# Altium schematic sheet Chip.SchDoc
size A4; SheetNumber: 2; SheetTotal: 4
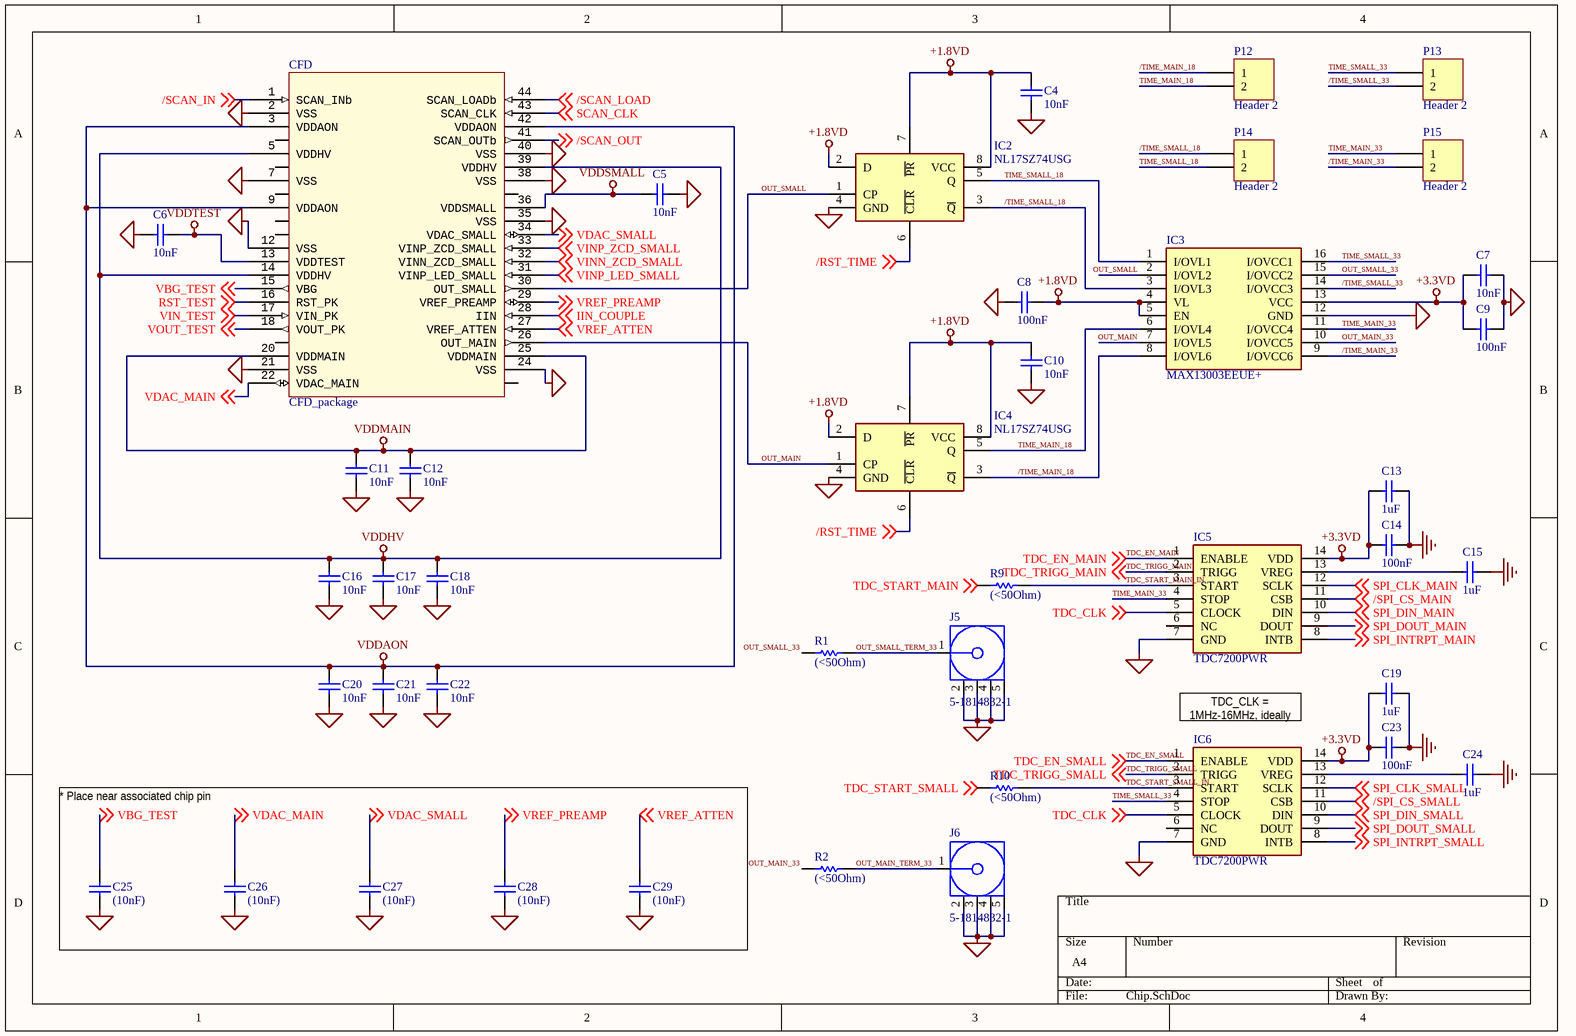
[diagram p0: Chip.SchDoc]

## Parts
C4  10nF  [CAPC1608X90X35ML10T15]
C5  10nF  [CAPC1608X90X35ML10T15]
C6  10nF  [CAPC1608X90X35ML10T15]
C7  10nF  [CAPC1608X90X35ML10T15]
C8  100nF  [CAPC1608X90X35ML10T15]
C9  100nF  [CAPC1608X90X35ML10T15]
C10  10nF  [CAPC1608X90X35ML10T15]
C11  10nF  [CAPC1608X90X35ML10T15]
C12  10nF  [CAPC1608X90X35ML10T15]
C13  1uF  [CAPC1608X90X35ML10T15]
C14  100nF  [CAPC1608X90X35ML10T15]
C15  1uF  [CAPC1608X90X35ML10T15]
C16  10nF  [CAPC1608X90X35ML10T15]
C17  10nF  [CAPC1608X90X35ML10T15]
C18  10nF  [CAPC1608X90X35ML10T15]
C19  1uF  [CAPC1608X90X35ML10T15]
C20  10nF  [CAPC1608X90X35ML10T15]
C21  10nF  [CAPC1608X90X35ML10T15]
C22  10nF  [CAPC1608X90X35ML10T15]
C23  100nF  [CAPC1608X90X35ML10T15]
C24  1uF  [CAPC1608X90X35ML10T15]
C25  (10nF)  [CAPC1608X90X35ML10T15]
C26  (10nF)  [CAPC1608X90X35ML10T15]
C27  (10nF)  [CAPC1608X90X35ML10T15]
C28  (10nF)  [CAPC1608X90X35ML10T15]
C29  (10nF)  [CAPC1608X90X35ML10T15]
CFD  CFD_package  [QFN50P700X700X80_HS-45N_WIDEVIAS]
IC2  NL17SZ74USG  [SOP50P310X90-8N]
IC3  MAX13003EEUE+  [SOP65P640X110-16N]
IC4  NL17SZ74USG  [SOP50P310X90-8N]
IC5  TDC7200PWR  [SOP65P640X120-14N]
IC6  TDC7200PWR  [SOP65P640X120-14N]
J5  5-1814832-1  [TECO-5-1814832-1_V]
J6  5-1814832-1  [TECO-5-1814832-1_V]
P12  Header 2  [HDR1X2]
P13  Header 2  [HDR1X2]
P14  Header 2  [HDR1X2]
P15  Header 2  [HDR1X2]
R1  (<50Ohm)  [RESC1609X50X30NL8T20]
R2  (<50Ohm)  [RESC1609X50X30NL8T20]
R9  (<50Ohm)  [RESC1609X50X30NL8T20]
R10  (<50Ohm)  [RESC1609X50X30NL8T20]

## Nets
+1.8VD: C4.2 C8.2 C10.2 IC2.2(D) IC2.7(~{PR}) IC2.8(VCC) IC3.4(VL) IC3.5(EN) IC4.2(D) IC4.7(~{PR}) IC4.8(VCC)
+3.3VD: C7.2 C9.2 C13.1 C14.1 C19.1 C23.1 IC3.13(VCC) IC5.14(VDD) IC6.14(VDD)
GND: C4.1 C5.1 C6.2 C7.1 C8.1 C9.1 C10.1 C11.1 C12.1 C13.2 C14.2 C15.2 C16.1 C17.1 C18.1 C19.2 C20.1 C21.1 C22.1 C23.2 C24.2 C25.1 C26.1 C27.1 C28.1 C29.1 CFD.2(VSS) CFD.7(VSS) CFD.12(VSS) CFD.21(VSS) CFD.24(VSS) CFD.35(VSS) CFD.38(VSS) CFD.40(VSS) IC2.4(GND) IC3.12(GND) IC4.4(GND) IC5.7(GND) IC6.7(GND) J5.2 J5.3 J5.4 J5.5 J6.2 J6.3 J6.4 J6.5
VDDAON: C20.2 C21.2 C22.2 CFD.3(VDDAON) CFD.9(VDDAON) CFD.42(VDDAON)
VDDHV: C16.2 C17.2 C18.2 CFD.5(VDDHV) CFD.14(VDDHV) CFD.39(VDDHV)
VDDMAIN: C11.2 C12.2 CFD.20(VDDMAIN) CFD.25(VDDMAIN)
VDDSMALL: C5.2 CFD.36(VDDSMALL)
VDDTEST: C6.1 CFD.13(VDDTEST)
/RST_TIME: IC2.6(~{CLR}) IC4.6(~{CLR}) ; off-sheet /RST_TIME
/SCAN_IN: CFD.1(SCAN_INb) ; off-sheet /SCAN_IN
/SCAN_LOAD: CFD.44(SCAN_LOADb) ; off-sheet /SCAN_LOAD
/SCAN_OUT: CFD.41(SCAN_OUTb) ; off-sheet /SCAN_OUT
/SPI_CS_MAIN: IC5.11(CSB) ; off-sheet /SPI_CS_MAIN
/SPI_CS_SMALL: IC6.11(CSB) ; off-sheet /SPI_CS_SMALL
/TIME_MAIN_18: IC3.8(I/OVL6) IC4.3(~{Q}) P12.1
/TIME_MAIN_33: IC3.9(I/OVCC6) P15.2
/TIME_SMALL_18: IC2.3(~{Q}) IC3.3(I/OVL3) P14.1
/TIME_SMALL_33: IC3.14(I/OVCC3) P13.2
IIN_COUPLE: CFD.28(IIN) ; off-sheet IIN_COUPLE
OUT_MAIN: CFD.26(OUT_MAIN) IC3.7(I/OVL5) IC4.1(CP)
OUT_MAIN_33: IC3.10(I/OVCC5) R2.2
OUT_MAIN_TERM_33: J6.1 R2.1
OUT_SMALL: CFD.30(OUT_SMALL) IC2.1(CP) IC3.2(I/OVL2)
OUT_SMALL_33: IC3.15(I/OVCC2) R1.2
OUT_SMALL_TERM_33: J5.1 R1.1
RST_TEST: CFD.16(RST_PK) ; off-sheet RST_TEST
SCAN_CLK: CFD.43(SCAN_CLK) ; off-sheet SCAN_CLK
SPI_CLK_MAIN: IC5.12(SCLK) ; off-sheet SPI_CLK_MAIN
SPI_CLK_SMALL: IC6.12(SCLK) ; off-sheet SPI_CLK_SMALL
SPI_DIN_MAIN: IC5.10(DIN) ; off-sheet SPI_DIN_MAIN
SPI_DIN_SMALL: IC6.10(DIN) ; off-sheet SPI_DIN_SMALL
SPI_DOUT_MAIN: IC5.9(DOUT) ; off-sheet SPI_DOUT_MAIN
SPI_DOUT_SMALL: IC6.9(DOUT) ; off-sheet SPI_DOUT_SMALL
SPI_INTRPT_MAIN: IC5.8(INTB) ; off-sheet SPI_INTRPT_MAIN
SPI_INTRPT_SMALL: IC6.8(INTB) ; off-sheet SPI_INTRPT_SMALL
TDC_CLK: IC5.5(CLOCK) IC6.5(CLOCK) ; off-sheet TDC_CLK
TDC_EN_MAIN: IC5.1(ENABLE) ; off-sheet TDC_EN_MAIN
TDC_EN_SMALL: IC6.1(ENABLE) ; off-sheet TDC_EN_SMALL
TDC_START_MAIN: R9.2 ; off-sheet TDC_START_MAIN
TDC_START_MAIN_IN: IC5.3(START) R9.1
TDC_START_SMALL: R10.2 ; off-sheet TDC_START_SMALL
TDC_START_SMALL_IN: IC6.3(START) R10.1
TDC_TRIGG_MAIN: IC5.2(TRIGG) ; off-sheet TDC_TRIGG_MAIN
TDC_TRIGG_SMALL: IC6.2(TRIGG) ; off-sheet TDC_TRIGG_SMALL
TIME_MAIN_18: IC3.6(I/OVL4) IC4.5(Q) P12.2
TIME_MAIN_33: IC3.11(I/OVCC4) IC5.4(STOP) P15.1
TIME_SMALL_18: IC2.5(Q) IC3.1(I/OVL1) P14.2
TIME_SMALL_33: IC3.16(I/OVCC1) IC6.4(STOP) P13.1
VBG_TEST: C25.2 CFD.15(VBG) ; off-sheet VBG_TEST
VDAC_MAIN: C26.2 CFD.22(VDAC_MAIN) ; off-sheet VDAC_MAIN
VDAC_SMALL: C27.2 CFD.34(VDAC_SMALL) ; off-sheet VDAC_SMALL
VIN_TEST: CFD.17(VIN_PK) ; off-sheet VIN_TEST
VINN_ZCD_SMALL: CFD.32(VINN_ZCD_SMALL) ; off-sheet VINN_ZCD_SMALL
VINP_LED_SMALL: CFD.31(VINP_LED_SMALL) ; off-sheet VINP_LED_SMALL
VINP_ZCD_SMALL: CFD.33(VINP_ZCD_SMALL) ; off-sheet VINP_ZCD_SMALL
VOUT_TEST: CFD.18(VOUT_PK) ; off-sheet VOUT_TEST
VREF_ATTEN: C29.2 CFD.27(VREF_ATTEN) ; off-sheet VREF_ATTEN
VREF_PREAMP: C28.2 CFD.29(VREF_PREAMP) ; off-sheet VREF_PREAMP
NetC15_1: C15.1 IC5.13(VREG)
NetC24_1: C24.1 IC6.13(VREG)

Not connected (* = marked no-connect by the designer): CFD 4 6 8 10 11 19 23 37; IC5 6(NC); IC6 6(NC)

## Notes on the sheet
- TDC_CLK = 1MHz-16MHz, ideally 16MHz
- * Place near associated chip pin

## Library data of the parts
C4-C29 = CMP-2000-04945-1: 0603; Manufacturer: Murata; Capacitance: 22pF; Tolerance (%): ±5%; Rated Voltage: 50V; Dielectric: C0G; Manufacturer URL: http://www.murata.com/; Datasheet Version: Jul-06; Package Reference: 603; Case Size/Dimension: 0603; Package Description: 2-Pin Surface Mount Device, Body 1.6 x 0.8 mm; Datasheet URL: https://datasheet.ciiva.com/11786/0900766b807a1cab-11786398.pdf
IC2 IC4 = NL17SZ74USG: Flip Flops 1.65-5.5V CMOS Single D-Type; Manufacturer_Name: ON Semiconductor; Datasheet Link: http://www.onsemi.com/pub/Collateral/NL17SZ74-D.PDF; Height: 0.9mm; Manufacturer_Part_Number: NL17SZ74USG
IC3 = MAX13003EEUE+: Integrated Circuit; Manufacturer_Name: Maxim Integrated; Datasheet Link: https://pdfserv.maximintegrated.com/en/ds/MAX13000E-MAX13005E.pdf; Height: 1.1mm; Manufacturer_Part_Number: MAX13003EEUE+
IC5 IC6 = TDC7200PWR: Integrated Circuit; Manufacturer_Name: Texas Instruments; Datasheet Link: http://www.ti.com/lit/gpn/tdc7200; Height: 1.2mm; Manufacturer_Part_Number: TDC7200PWR
J5 J6 = CMP-2000-05415-1: SMA Connector, Pitch 5.08 mm, 1 Position, Height 9.5 mm, Tail Length 4 mm, -65 to 165 degC, RoHS, Bulk; Manufacturer: TE Connectivity; Connector Mounting: PCBMount; Connector Body Style: StraightJack; Impedance: 50ohm; Coaxial Termination: Solder; SVHC: NoSVHC(15-Jun-2015); Frequency Max: 3GHz; Product Range: ZDCSeries; Connector Type: SMACoaxial; Datasheet Version: Rev. B1, 03/2011; Package Reference: 5-1814832-1; Package Description: SMA Connector, Pitch 5.08 mm, 1 Position, Height 9.5 mm, Tail Length 4 mm; Contact Plating: GoldPlatedContacts; Coaxial Cable Types: -; Contact Material: BerylliumCopper; Manufacturer URL: http://www.te.com/; Datasheet URL: http://www.onlinecomponents.com/productFiles/mf-AMP/eng_cd_1814832_a.pdf
P12-P15 = Header 2: Header, 2-Pin; LatestRevisionDate: 17-Jul-2002; LatestRevisionNote: Re-released for DXP Platform.; Publisher: Altium Limited
R1 R2 R9 R10 = CMP-2000-03816-5: 0603; Manufacturer: Vishay Semiconductor; Voltage Rating: 75 V; Package Quantity: 5000; DatasheetVersion: 06/2012; Min Operating Temperature: -55 degC; ComponentLink1URL: http://www.vishay.com/; Mounting Technology: Surface Mount; Height: 0.45 mm; ComponentLink1Description: Manufacturer URL; REACH SVHC: Unknown; PackageReference: 0603; Packaging: Tape and Reel; Max Operating Temperature: 155 degC; Mount: Surface Mount; ComponentLink2Description: Datasheet; PackageDescription: 2-Pin Surface Mount Device, Body 1.575 x 0.85 mm; Length: 1.55 mm; ComponentLink2URL: http://www.vishay.com/docs/20035/dcrcwe3.pdf; Pins: 2; RoHSCompliant: true